# Altium schematic sheet Principal.SchDoc
size 420 x 297 mm; SheetNumber: 3; SheetTotal: 3
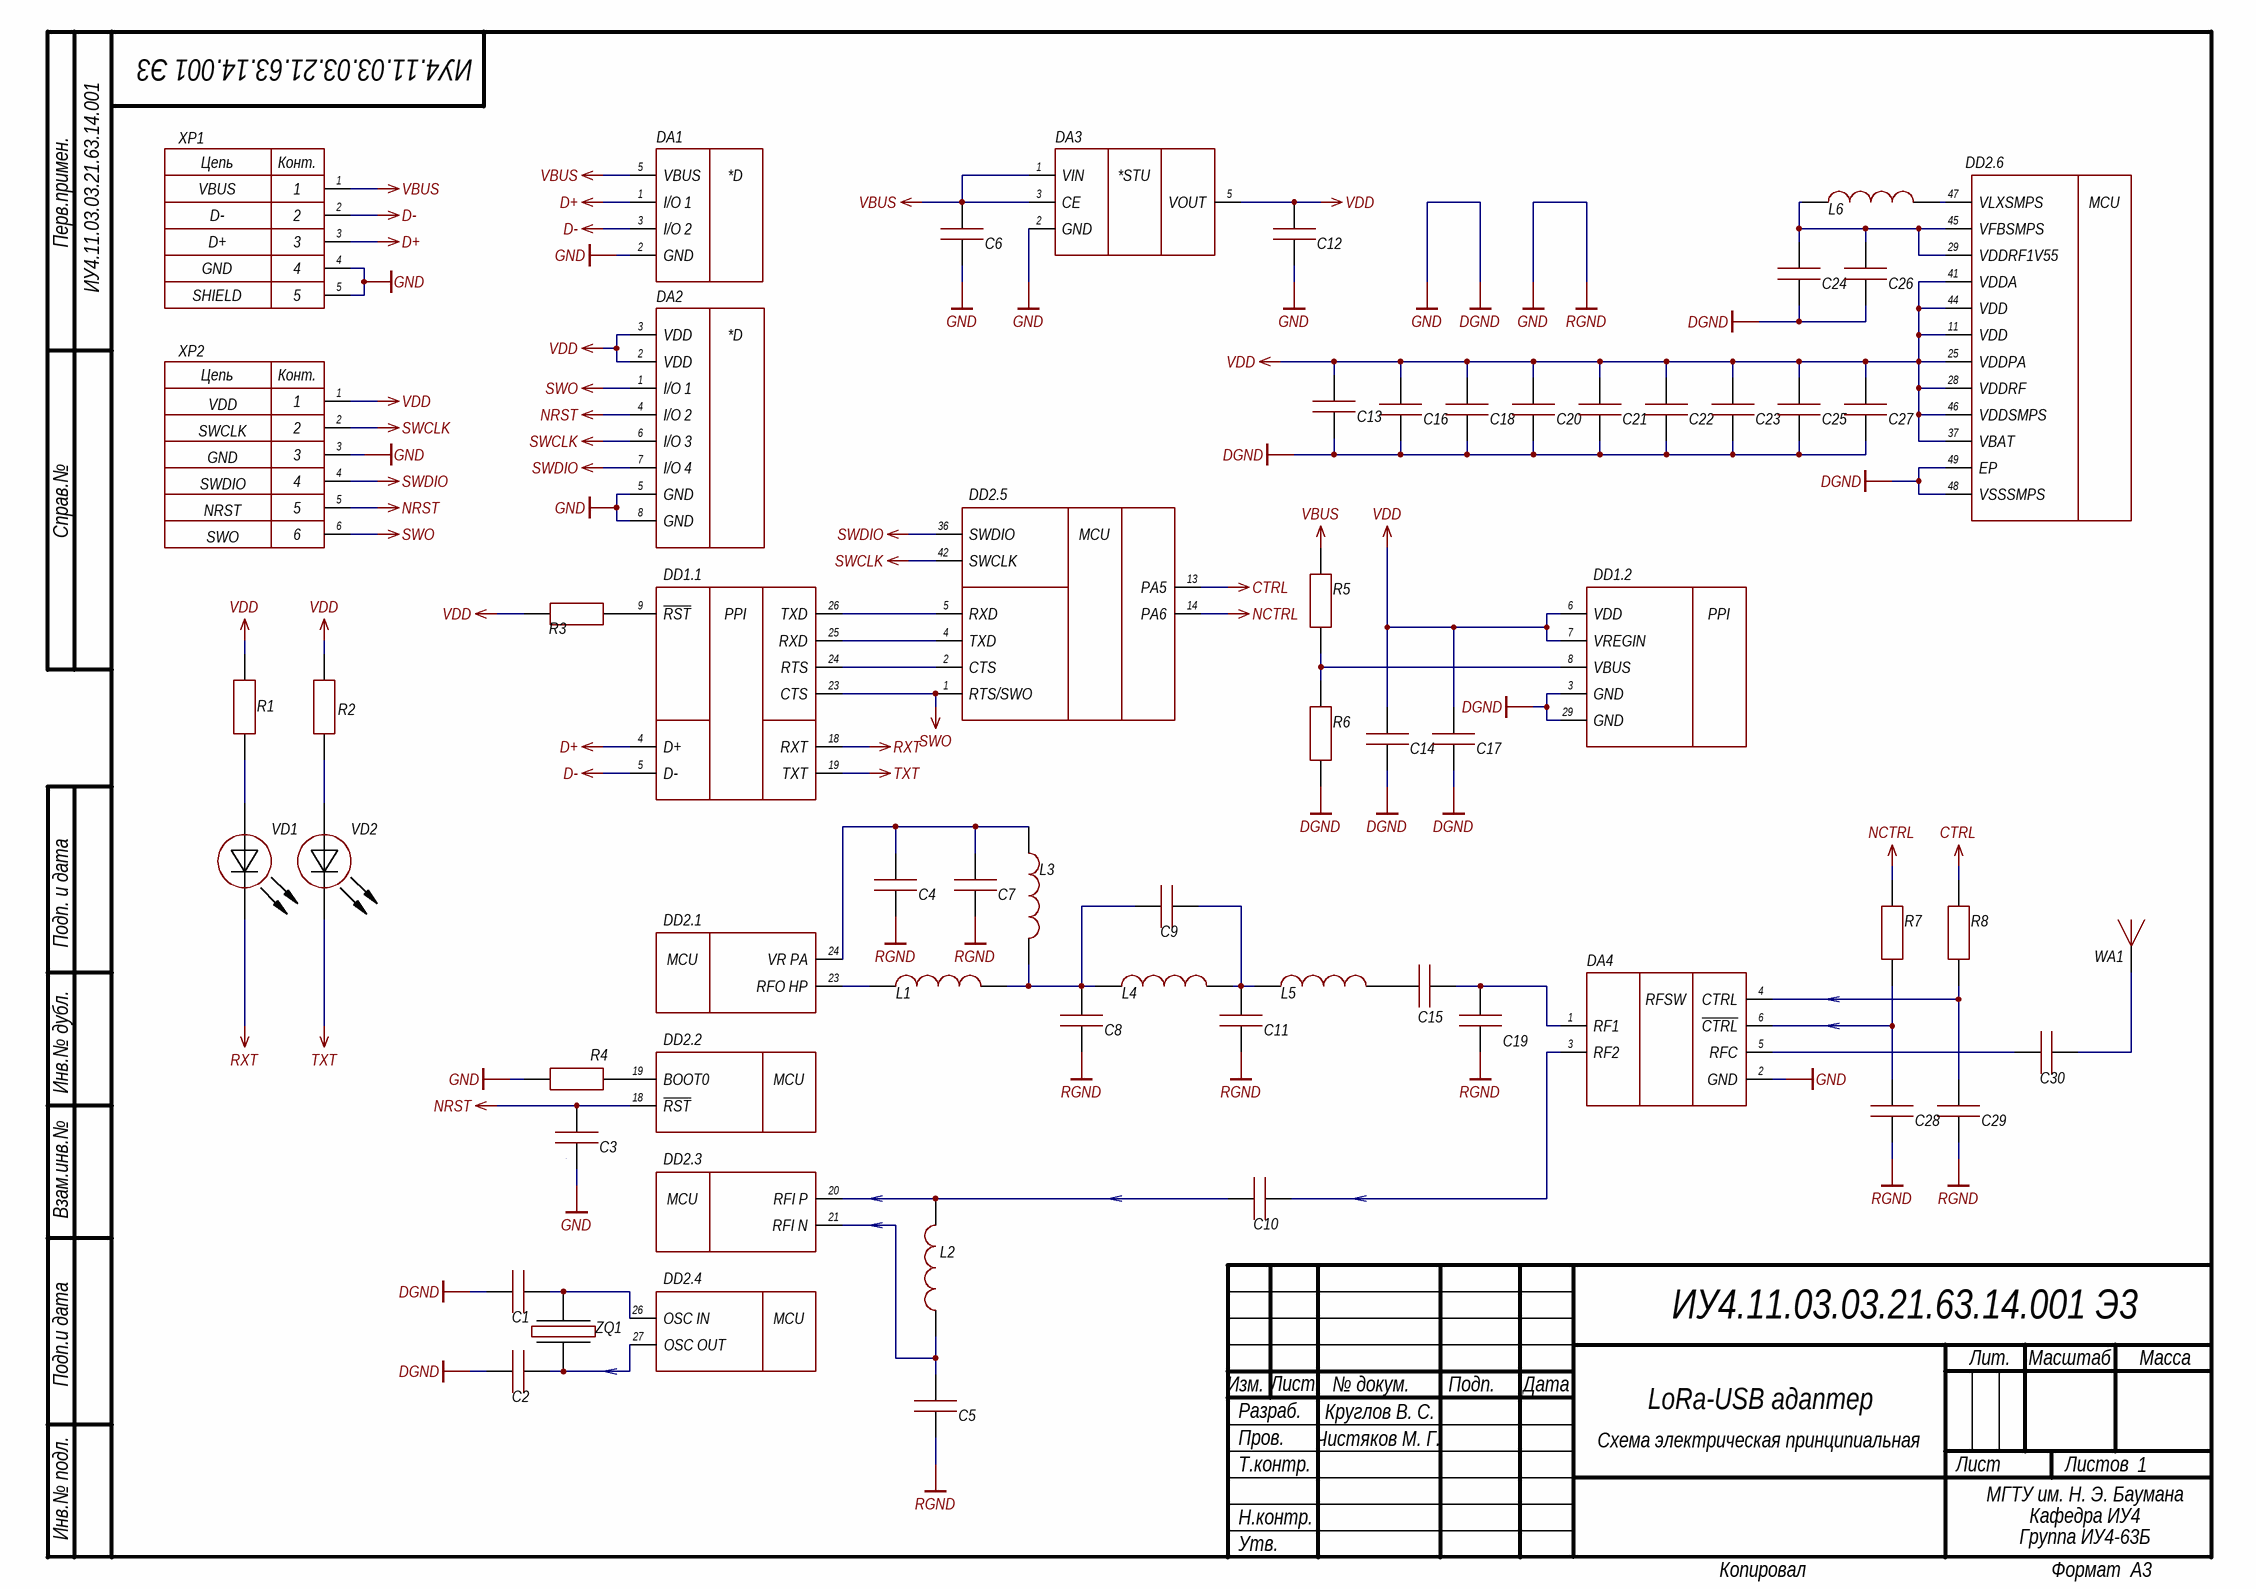
[diagram p0: Principal.SchDoc]

## Parts
C1  04023J0R9BBWTR  [CAP: 0402]  (value not drawn)
C2  04023J0R9BBWTR  [CAP: 0402]  (value not drawn)
C3  04023J0R9BBWTR  [CAP: 0402]  (value not drawn)
C4  04023J0R9BBWTR  [CAP: 0402]  (value not drawn)
C5  04023J0R9BBWTR  [CAP: 0402]  (value not drawn)
C6  04023J0R9BBWTR  [CAP: 0402]  (value not drawn)
C7  04023J0R9BBWTR  [CAP: 0402]  (value not drawn)
C8  04023J0R9BBWTR  [CAP: 0402]  (value not drawn)
C9  04023J0R9BBWTR  [CAP: 0402]  (value not drawn)
C10  04023J0R9BBWTR  [CAP: 0402]  (value not drawn)
C11  04023J0R9BBWTR  [CAP: 0402]  (value not drawn)
C12  04023J0R9BBWTR  [CAP: 0402]  (value not drawn)
C13  04023J0R9BBWTR  [CAP: 0402]  (value not drawn)
C14  04023J0R9BBWTR  [CAP: 0402]  (value not drawn)
C15  04023J0R9BBWTR  [CAP: 0402]  (value not drawn)
C16  04023J0R9BBWTR  [CAP: 0402]  (value not drawn)
C17  04023J0R9BBWTR  [CAP: 0402]  (value not drawn)
C18  04023J0R9BBWTR  [CAP: 0402]  (value not drawn)
C19  04023J0R9BBWTR  [CAP: 0402]  (value not drawn)
C20  04023J0R9BBWTR  [CAP: 0402]  (value not drawn)
C21  04023J0R9BBWTR  [CAP: 0402]  (value not drawn)
C22  04023J0R9BBWTR  [CAP: 0402]  (value not drawn)
C23  04023J0R9BBWTR  [CAP: 0402]  (value not drawn)
C24  04023J0R9BBWTR  [CAP: 0402]  (value not drawn)
C25  04023J0R9BBWTR  [CAP: 0402]  (value not drawn)
C26  04023J0R9BBWTR  [CAP: 0402]  (value not drawn)
C27  04023J0R9BBWTR  [CAP: 0402]  (value not drawn)
C28  04023J0R9BBWTR  [CAP: 0402]  (value not drawn)
C29  04023J0R9BBWTR  [CAP: 0402]  (value not drawn)
C30  04023J0R9BBWTR  [CAP: 0402]  (value not drawn)
DA1  SRV05-4.TCT  [SMTC-SOT23-6_V]  (value not drawn)
DA2  SRDA3.3-4DR2G  [8-SOIC]  (value not drawn)
DA3  XC6219B332MR  [SOT23-5]  (value not drawn)
DA4  HMC544AETR  [FP-RJ-6-IPC_C]  (value not drawn)
DD1  CP2102N-A02-GQFN28R  [FP-CP2102N-A02-GQFN28R-IPC_C]  (value not drawn)  (parts A,B of 2)
DD2  STM32WLE5CCU6  [FP-UFQFPN48-A0B9-MFG]  (value not drawn)  (parts A,B,C,D,E,F of 6)
L1  LQW15AN4N3C00D  [IND: 0402]  (value not drawn)
L2  LQW15AN4N3C00D  [IND: 0402]  (value not drawn)
L3  LQW15AN4N3C00D  [IND: 0402]  (value not drawn)
L4  LQW15AN4N3C00D  [IND: 0402]  (value not drawn)
L5  LQW15AN4N3C00D  [IND: 0402]  (value not drawn)
L6  LQW15AN4N3C00D  [IND: 0402]  (value not drawn)
R1  RC0402FR-074K7L  [RES: 0402]  (value not drawn)
R2  RC0402FR-074K7L  [RES: 0402]  (value not drawn)
R3  RC0402FR-074K7L  [RES: 0402]  (value not drawn)
R4  RC0402FR-074K7L  [RES: 0402]  (value not drawn)
R5  RC0402FR-074K7L  [RES: 0402]  (value not drawn)
R6  RC0402FR-074K7L  [RES: 0402]  (value not drawn)
R7  RC0402FR-074K7L  [RES: 0402]  (value not drawn)
R8  RC0402FR-074K7L  [RES: 0402]  (value not drawn)
VD1  (no value)  [LED: 0805R]
VD2  (no value)  [LED: 0805G]
WA1  Antenna  [ANTENNA]  (value not drawn)
XP1  480-37-1000  [MOLX-480-37-1000_V]  (value not drawn)
XP2  Connector PLS-6  [PLS-6]  (value not drawn)
ZQ1  *  [OSC: 2016]  (value not drawn)

## Nets
CTRL: DD2.13(PA5) R8.1
D+: DA1.1(I/O_1) DD1.4(D+) XP1.3(D+)
D-: DA1.3(I/O_2) DD1.5(D-) XP1.2(D-)
DGND: C1.1 C2.1 C3.1 C4.1 C5.1 C6.2 C7.1 C8.1 C11.1 C12.2 C13.2 C14.2 C16.2 C17.2 C18.2 C19.1 C20.2 C21.2 C22.2 C23.2 C24.2 C25.2 C26.2 C27.2 C28.1 C29.1 DA1.2(GND) DA2.5(GND) DA2.8(GND) DA3.2(GND) DA4.2(GND) DD1.3(GND) DD1.29(GND) DD2.48(VSSSMPS) DD2.49(EP) R4.2 R6.1 XP1.4(GND) XP1.5(SHLD) XP2.3  [also labelled GND, RGND]
NCTRL: DD2.14(PA6) R7.1
NRST: C3.2 DA2.4(I/O_2) DD2.18(~{RST}) XP2.5
RXT: DD1.18(RXT) VD1.2(C)
SWCLK: DA2.6(I/O_3) DD2.42(SWCLK) XP2.2
SWDIO: DA2.7(I/O_4) DD2.36(SWDIO) XP2.4
SWO: DA2.1(I/O_1) DD1.23(CTS) DD2.1(RTS/SWO) XP2.6
TXT: DD1.19(TXT) VD2.2(C)
VBUS: C6.1 DA1.5(VBUS) DA3.1(VIN) DA3.3(CE) R5.2 XP1.1(VBUS)
VDD: C12.1 C13.1 C14.1 C16.1 C17.1 C18.1 C20.1 C21.1 C22.1 C23.1 C25.1 C27.1 DA2.2(VDD) DA2.3(VDD) DA3.5(VOUT) DD1.6(VDD) DD1.7(VREGIN) DD2.11(VDD) DD2.25(VDDPA) DD2.28(VDDRF) DD2.37(VBAT) DD2.41(VDDA) DD2.44(VDD) DD2.46(VDDSMPS) R1.1 R2.1 R3.1 XP2.1
NetC1_2: C1.2 DD2.26(OSC_IN) ZQ1.3
NetC2_2: C2.2 DD2.27(OSC_OUT) ZQ1.1
NetC4_2: C4.2 C7.2 DD2.24(VR_PA) L3.1
NetC5_2: C5.2 DD2.21(RFI_N) L2.1
NetC8_2: C8.2 C9.2 L1.2 L3.2 L4.1
NetC9_1: C9.1 C11.2 L4.2 L5.1
NetC10_1: C10.1 DA4.3(RF2)
NetC10_2: C10.2 DD2.20(RFI_P) L2.2
NetC15_1: C15.1 L5.2
NetC15_2: C15.2 C19.2 DA4.1(RF1)
NetC24_1: C24.1 C26.1 DD2.29(VDDRF1V55) DD2.45(VFBSMPS) L6.1
NetC28_2: C28.2 DA4.6(~{CTRL}) R7.2
NetC29_2: C29.2 DA4.4(CTRL) R8.2
NetC30_1: C30.1 WA1.1
NetC30_2: C30.2 DA4.5(RFC)
NetDD1_8: DD1.8(VBUS) R5.1 R6.2
NetDD1_9: DD1.9(~{RST}) R3.2
NetDD1_24: DD1.24(RTS) DD2.2(CTS)
NetDD1_25: DD1.25(RXD) DD2.4(TXD)
NetDD1_26: DD1.26(TXD) DD2.5(RXD)
NetDD2_19: DD2.19(BOOT0) R4.1
NetDD2_23: DD2.23(RFO_HP) L1.1
NetDD2_47: DD2.47(VLXSMPS) L6.2
NetR1_2: R1.2 VD1.1(A)
NetR2_2: R2.2 VD2.1(A)

## Notes on the sheet
- ИУ4.11.03.03.21.63.14.001 Э3
- ИУ4.11.03.03.21.63.14.001
- (near DD2) DD2.6
- VDD
- SWCLK
- GND
- SWDIO
- NRST
- SWO
- (near DD2) DD2.5
- DD1.1
- (near DD1) DD1.2
- DD2.1
- (near DD2) DD2.2
- (near DD2) DD2.3
- (near DD2) DD2.4
- Круглов В. С.
- LoRa-USB адаптер
- Чистяков М. Г.
- Схема электрическая принципиальная
- 1
- МГТУ им. Н. Э. Баумана
- Кафедра ИУ4
- Группа ИУ4-63Б
- Перв.примен.
- Справ.№
- Подп. и дата
- Инв.№ дубл.
- Взам.инв.№
- Подп.и дата
- Разраб.
- Изм.
- Лист
- № докум.
- Подп.
- Дата
- Лит.
- Масштаб
- Масса
- Т.контр.
- Пров.
- Листов
- Инв.№ подл.
- Утв.
- Н.контр.
- Копировал
- Формат  A3
- (in symbol CMP-1063-00128-1) *D
- (in symbol CMP-2000-05358-1) *D
- (in symbol CMP-08093-000007-1, part A) PPI
- (in symbol CMP-08093-000007-1, part B) PPI
- (in symbol CMP-09141-000069-1) RFSW
- (in symbol CMP-12105-000100-1, part A) MCU
- (in symbol CMP-12105-000100-1, part B) MCU
- (in symbol CMP-12105-000100-1, part C) MCU
- (in symbol CMP-12105-000100-1, part D) MCU
- (in symbol CMP-12105-000100-1, part E) MCU
- (in symbol CMP-12105-000100-1, part F) MCU
- (in symbol Connector PLS-6) Цепь; Конт.
- (in symbol STU) *STU
- (in symbol USB-A plug) Цепь; Конт.; SHIELD

## Library data of the parts
C1-C30 = C: Manufacturer: AVX Interconnect / Elco; Part Number: 04023J0R9BBWTR
DA1 = CMP-2000-05358-1: RailClamp(R) Low Capacitance TVS Diode Array, 5 pF, 17.5 VC, -55 to 125 degC, 6-Pin SOT23, RoHS, Tape and Reel; Manufacturer: Semtech; Leakage Current (Max): 5uA; Polarity: Uni-Directional; Peak Pulse Power Dissipation: 300W; Clamping Voltage: 17.5V; Number of Elements: 1; Working Voltage: 5V; Test Current (It): 1mA; Configuration: Quad; Reverse Breakdown Voltage: 6V; Suppressor Type: DiodeArrays; Peak Pulse Current: 12A; Product Depth (mm): 1.6mm; Product Height (mm): 1.15mm; Clamping Voltage (Max): 12.5V; Rad Hardened: No; Product Length (mm): 2.9mm; Capacitance Value: 5pF; Mounting: SurfaceMount; Datasheet URL: https://datasheet.ciiva.com/8029/srv05-4-8029973.pdf; Datasheet Version: Jan-08; Packaging: TapeandReel; Package / Case: SOT-23; Operating Temp Range: -55Cto125C; Pin Count: 6; Direction Type: Uni-Directional; Operating Temperature Min Deg. C: -55C; Reverse Stand-off Voltage: 5V; Leakage Current: 5uA; Manufacturer URL: http://www.semtech.com/; Working Voltage (Max): 5V; Package Reference: SOT23-6; Package Description: 6-Pin Small Outline Transistor, Body 2.9 x 1.6 mm, Pitch 0.95 mm; Operating Temperature Max Deg. C: 125C; Operating Temperature Classification: Military; Mounting Style: SurfaceMount
DA2 = CMP-1063-00128-1: Low Capacitance Surface Mount TVS for High-Speed Data Interface, 8-Pin SOIC, Pb-Free, Tape and Reel; Manufacturer: On Semiconductor; V(BR) Min (V): 5; PPK Max (W): 500; Number of Lines: 4; VRWM Max (V): 3.3; Direction: Unidirectional; ComponentLink3Description: Package Specification; ComponentLink1Description: Manufacturer URL; ComponentLink1URL: http://www.onsemi.com/; RoHS: Pb-Free; Mounting Technology: Surface Mount; ComponentLink3URL: http://www.onsemi.com/pub_link/Collateral/751-07.PDF; PackageVersion: Rev. AK, 02/2011; ComponentLink2Description: Datasheet; PackageReference: SOIC-8-751-07; PartNumber: SRDA3.3-4DR2G; PackageDescription: 8-Pin Small Outline Integrated Circuit, Body 4.9 x 3.9 mm, Pitch 1.27 mm; Packing: Tape and Reel; ComponentLink2URL: http://www.onsemi.cn/pub_link/Collateral/SRDA3.3-4-D.PDF; DatasheetVersion: Rev. 0; IR Max (uA): 5
DA3 = STU: LDO Voltage Regulators 0.3A, 3.3V
DA4 = CMP-09141-000069-1: IC RF SWITCH SPDT 4GHZ SOT26; Max Power Dissipation: 574mW; Impedance: 50R; P1dB: 39dBm; IIP3: 60dBm; Contact Plating: Tin; Mount: Surface Mount; Number of Pins: 6; REACH SVHC: No SVHC; Packaging: Cut Tape; Case/Package: SOT-26; Throw Configuration: SPDT; RoHS Compliant: Yes; Min Operating Temperature: -40°C; Max Frequency: 4GHz; Lead Free: Contains Lead; Max Operating Temperature: 85°C
DD1 = CMP-08093-000007-1: IC USB TO UART BRIDGE QFN28
DD2 = CMP-12105-000100-1: MULTIPROTOCOL LPWAN 32-BIT ARM C
L1-L6 = L: Wire Wound RF Inductor 4.3nH ±0.2nH 750mA 0.07Ω 0402 (1005); Core Material: Air; Shielding: Unshielded; Self Resonant Frequency: 10GHz; Test Frequency: 100MHz; DC Resistance (DCR): 70mR; Q Factor: 25; REACH SVHC: No SVHC; Min Operating Temperature: -55°C; Termination: SMD/SMT; Current Rating: 750mA; Weight: 2.8E-05oz; Inductance: 4.3nH; Number of Pins: 2; Mount: Surface Mount; Lead Free: Lead Free; Length: 1mm; Depth: 0.7mm; Radiation Hardening: No; Case/Package: 0402; Packaging: Tape and Reel; Military Standard: Not; Case Code (Imperial): 0402; Package Quantity: 10000; Case Code (Metric): 1005; Max DC Current: 750mA; Width: 0.02inch; Max Operating Temperature: 125°C; Height: 0.5mm; DC Current: 750mA
R1-R8 = R: Manufacturer: Yageo / Phycomp; Part Number: RC0402FR-074K7L
VD1 VD2 = LED_single: ValueManufacturerPartNumber: LED, Green, *, *, *, -55...+150°C; TypeDiode: LED; ColorParameter: Green; Manufacturer: *; Package: *; HelpURL: *; Temperature: -55...+150°C; Current: *; VoltageDrop: *; PartNumber: *; Color: GREEN
XP1 = USB-A plug: Universal Serial Bus (USB) Shielded I/O Plug, Type A, Right Angle Connector, 1.5 A, -20 to 85 degC, 4-Pin SMD, RoHS, Tray; Voltage Rating (DC): 50 V; Tolerance: 1%; Resistance: 1 mohm; Power Rating: 100 mW; Case\Package: 0603; PackageDescription: 4-Pin Surface Mount Device, Body 12 x 18.8 mm; Max Operating Temperature: 155 degC; PackageReference: 480-37-1000; ComponentLink2Description: Datasheet; ComponentLink1Description: Manufacturer URL; Packaging: Tape and Reel; REACH SVHC: No SVHC; Width: 0.8 mm; Case Code (Imperial): 0603; Pins: 2; Length: 1.6 mm; DatasheetVersion: Rev. D, 06/2004; Voltage Rating: 50 V; ComponentLink1URL: http://www.molex.com/; Mount: Surface Mount; Case Code (Metric): 1608; ComponentLink2URL: http://www.molex.com/pdm_docs/sd/480371000_sd.pdf; RoHSCompliant: true; Min Operating Temperature: -55 degC; Package Quantity: 5000; Height: 0.45 mm
ZQ1 = Oscillator: Manufacturer: *; ComponentKind: *; HelpURL: *; Model: *; Value: *